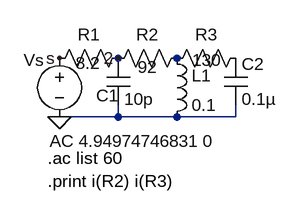
[diagram p0: schematic ECE2101L_Lab10_B1.asc]
ECE2101L_Lab10_B1.asc, the LTspice schematic file:
Version 4
SHEET 1 880 680
WIRE 48 176 48 160
WIRE 48 176 -32 176
WIRE 128 176 48 176
WIRE 208 176 208 160
WIRE 208 176 128 176
FLAG -32 176 0
FLAG -32 96 s
FLAG 48 96 2
SYMBOL voltage -32 80 R0
WINDOW 123 -13 129 Left 2
WINDOW 39 0 0 Left 0
WINDOW 0 -49 19 Left 2
SYMATTR Value2 AC 4.94974746831 0
SYMATTR InstName Vs
SYMATTR Value ""
SYMBOL res -48 112 R270
WINDOW 0 32 56 VTop 2
WINDOW 3 25 55 VBottom 2
SYMATTR InstName R1
SYMATTR Value 8.2
SYMBOL cap 32 96 R0
WINDOW 0 -14 51 Left 2
SYMATTR InstName C1
SYMATTR Value 10p
SYMBOL res 32 112 R270
WINDOW 0 32 56 VTop 2
WINDOW 3 19 56 VBottom 2
SYMATTR InstName R2
SYMATTR Value 92
SYMBOL ind 112 80 R0
SYMATTR InstName L1
SYMATTR Value 0.1
SYMBOL cap 192 96 R0
SYMATTR InstName C2
SYMATTR Value 0.1µ
SYMBOL res 112 112 R270
WINDOW 0 32 56 VTop 2
WINDOW 3 29 57 VBottom 2
SYMATTR InstName R3
SYMATTR Value 130
TEXT -48 232 Left 2 !.ac list 60\n.print i(R2) i(R3)

The netlist it stands for:
* ECE2101L_Lab10_B1.asc
Vs s 0 AC 4.94974746831 0
R1 s 2 8.2
C1 2 0 10p
R2 2 P001 92
L1 P001 0 0.1
C2 P002 0 0.1µ
R3 P001 P002 130
.ac list 60
.print i(R2) i(R3)
.backanno
.end